# Altium schematic sheet Interface Diagram.SchDoc: Interface Board Diagram
size A4; DrawnBy: PSM; Engineer: PSM; Organization: Panther Racing; Revision: 0; SheetNumber: 2; SheetTotal: 2
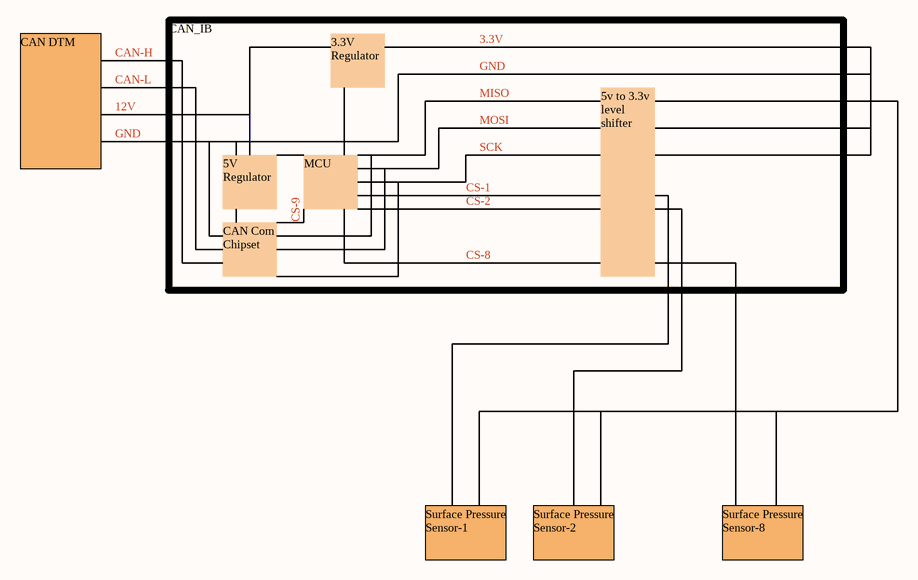
[diagram p0: Interface Diagram.SchDoc]

## Notes on the sheet
- CAN-H
- CAN-L
- 3.3V Regulator
- 3.3V
- GND
- 12V
- MISO
- MOSI
- SCK
- CAN DTM
- 5V Regulator
- MCU
- CS-9
- CS-1
- CS-2
- CAN_IB
- CAN Com Chipset
- ...
- CS-8
- 5v to 3.3v level shifter
- Surface Pressure Sensor-1
- Surface Pressure Sensor-2
- Surface Pressure Sensor-8
- DWG. NO.
- REV.
- SHT.
- THIS DOCUMENT AND THE DATA DISCLOSED HEREIN OR HEREWITH IS THE PROPERTY OF ALTIUM LIMITED AND MAY BE FREELY DISTRIBUTED IN WHOLE. NO RIGHTS ARE RESERVED OR EXPRESS OR IMPLIED WARANTEE GIVEN.
- REVISION
- DESCRIPTION
- DATE
- APPROVED
- ENG:
- APPROVALS
- PROJECT
- DSN:
- CHK:
- REFERENCE DOCUMENTS
- PROJECT REVISION:
- TITLE
- DOCUMENT REVISION:
- DESIGN ITEM:
- BOM:
- FAB DWG:
- PCB DWG:
- ASSY DWG:
- SCALE:
- SIZE
- B
- CAGE CODE
- FILE NAME
- DWG NO.
- SHEET
- OF
- REV